# EAGLE design Overgang (EAGLE 6.4)
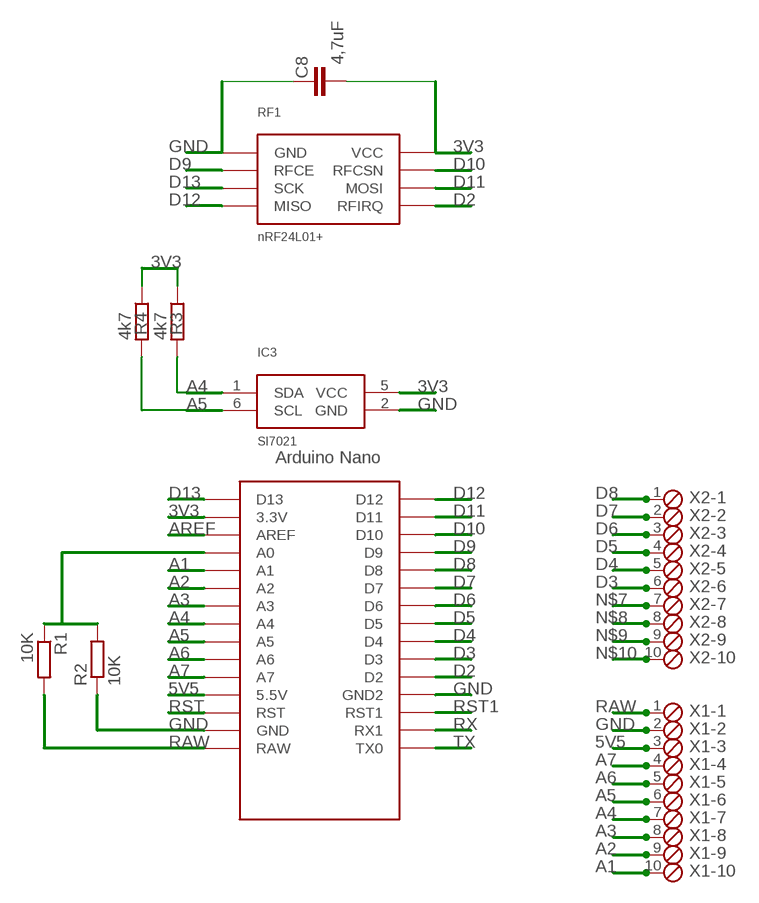
[diagram p0: schematic, sheet 1]

## Parts
C8  4,7uF  C-EUC1206K  [C1206K]
IC3  SI7021  [DFN6]
R1  10K  R-EU_R0805  [R0805]
R2  10K  R-EU_R0805  [R0805]
R3  4k7  R-EU_R0805  [R0805]
R4  4k7  R-EU_R0805  [R0805]
RF1  nRF24L01+  NRF24L01  [2X4-2.54MM]
U$1  NANO  [NANO]
X1  MPT10  [10POL254]
X2  MPT10  [10POL254]

## Nets
3V3: C8.1 IC3.5(VCC) R3.1 R4.1 RF1.P$2(VCC) U$1.3.3V
5V5: U$1.5V(5.5V) X1.3
A1: U$1.A1 X1.10
A2: U$1.A2 X1.9
A3: U$1.A3 X1.8
A4: IC3.1(SDA) R3.2 U$1.A4 X1.7
A5: IC3.6(SCL) R4.2 U$1.A5 X1.6
A6: U$1.A6 X1.5
A7: U$1.A7 X1.4
AREF: U$1.AREF
D2: RF1.P$8(RFIRQ) U$1.D2
D3: U$1.D3 X2.6
D4: U$1.D4 X2.5
D5: U$1.D5 X2.4
D6: U$1.D6 X2.3
D7: U$1.D7 X2.2
D8: U$1.D8 X2.1
D9: RF1.P$3(RFCE) U$1.D9
D10: RF1.P$4(RFCSN) U$1.D10
D11: RF1.P$6(MOSI) U$1.D11
D12: RF1.P$7(MISO) U$1.D12
D13: RF1.P$5(SCK) U$1.D13
GND: C8.2 IC3.2(GND) R2.1 RF1.P$1(GND) U$1.GND U$1.GND1(GND2) X1.2
N$2: R1.1 R2.2 U$1.A0
N$7: X2.7
N$8: X2.8
N$9: X2.9
N$10: X2.10
RAW: R1.2 U$1.RAW X1.1
RST: U$1.RST
RST1: U$1.RST1
RX: U$1.RX1
TX: U$1.TX0
Unconnected: U$1.ICSP1 U$1.ICSP2 U$1.ICSP3 U$1.ICSP4 U$1.ICSP5 U$1.ICSP6

## Library data of the parts
C8 = rcl:C-EU: CAPACITOR, European symbol
IC3 = Sensor:SI7021
R1-R4 = rcl:R-EU_: RESISTOR, European symbol
RF1 = matrix:NRF24L01
U$1 = AWP-Lib2:NANO: Arduino Nano
X1 X2 = con-phoenix-254:MPT10: PHOENIX CONNECTOR

## Net classes
0 default: width 0.203 mm

## Board
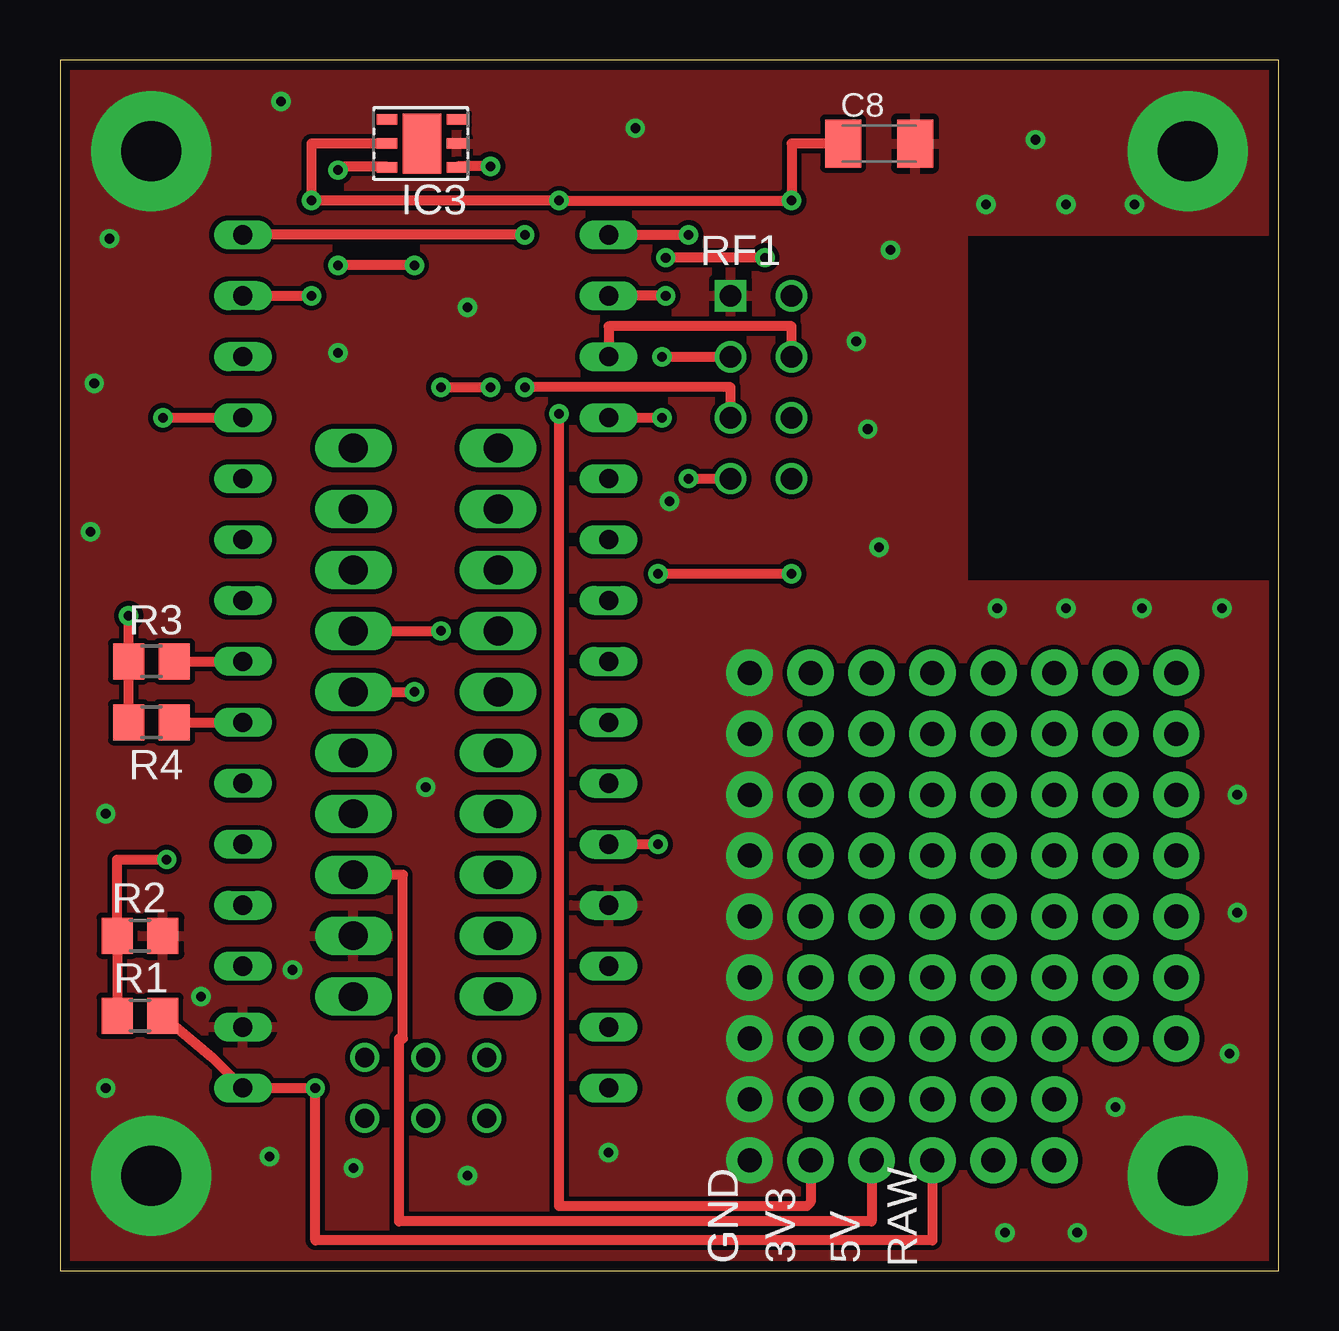
[diagram p1: board, top side]
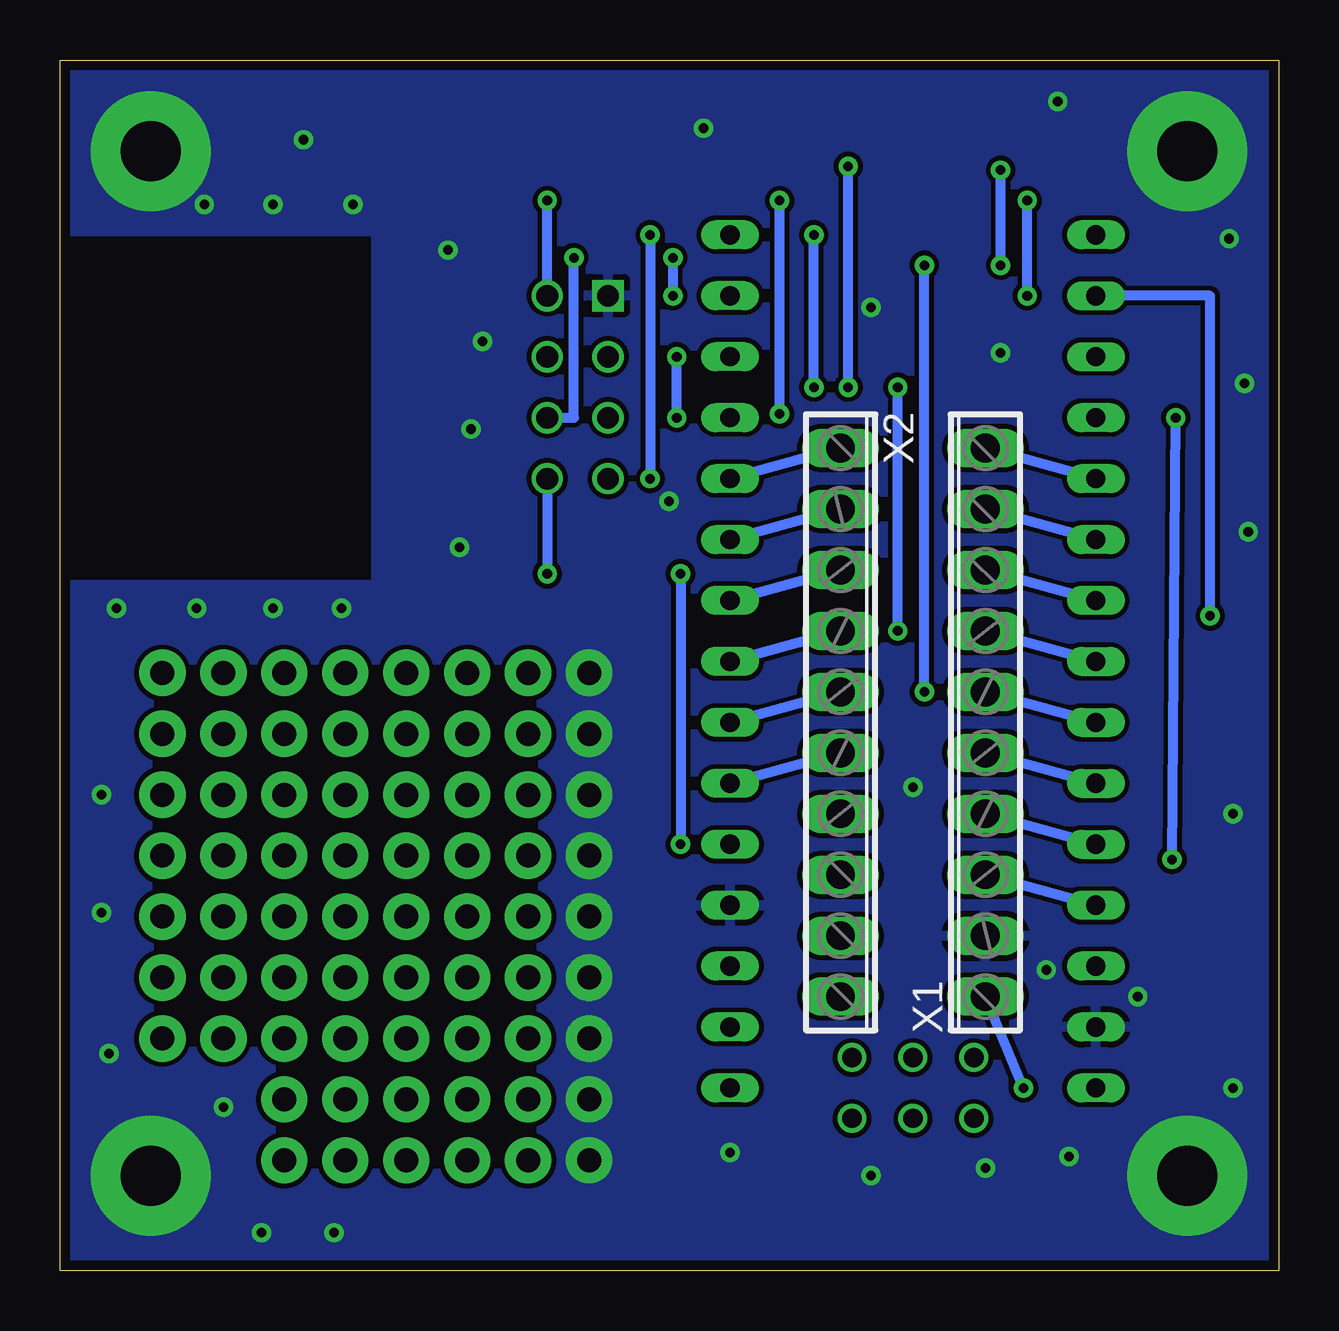
[diagram p2: board, bottom side, seen from below]

Size 50.78 x 50.47 mm. Coordinates in mm from the lower left corner, seen from the top.
Outline: 0,0 50.78,0 50.78,50.47 0,50.47 0,0
Copper layers (1*16): Top 0.035mm / dielectric 1.5mm / Bottom 0.035mm
Design rules "8mil_capinor": minimum track width 4mil, minimum drill 0.2997mm, track to track 8mil, track to pad 8mil, pad to pad 8mil, via to via 8mil, smd to smd 0mil, copper to edge 16mil, drill to drill 16mil, minimum pad ring 8mil, minimum via ring 8mil, stop-mask expansion 0mil, vias tented up to drill 16mil, thermal gap 10mil

### Footprints (pad centres in the part's own frame; a part is rotated, then mirrored left to right if it is on the bottom)
C1206K = smd 1.5 x 2: 1 -1.5,0; 2 1.5,0
DFN6 = smd 0.85 x 0.45: 1 -1.45,1; 2 -1.45,0; 3 -1.45,-1; 4 1.45,-1; 5 1.45,0; 6 1.45,1 | smd 1.6 x 2.5: P$1 0,0
R0805 = smd 1.3 x 1.5: 1 -0.95,0; 2 0.95,0
2X4-2.54MM = drill 0.9 square: P$1 0,0 | drill 0.9: P$2 2.54,0; P$3 0,-2.54; P$4 2.54,-2.54; P$5 0,-5.08; P$6 2.54,-5.08; P$7 0,-7.62; P$8 2.54,-7.62
NANO = drill 0.8 long: 3.3V -10.16,24.13; 5V -10.16,-1.27; A0 -10.16,19.05; A1 -10.16,16.51; A2 -10.16,13.97; A3 -10.16,11.43; A4 -10.16,8.89; A5 -10.16,6.35; A6 -10.16,3.81; A7 -10.16,1.27; AREF -10.16,21.59; D2 5.08,1.27; D3 5.08,3.81; D4 5.08,6.35; D5 5.08,8.89; D6 5.08,11.43; D7 5.08,13.97; D8 5.08,16.51; D9 5.08,19.05; D10 5.08,21.59; D11 5.08,24.13; D12 5.08,26.67; D13 -10.16,26.67; GND -10.16,-6.35; GND1 5.08,-1.27; RAW -10.16,-8.89; RST -10.16,-3.81; RST1 5.08,-3.81; RX1 5.08,-6.35; TX0 5.08,-8.89 | drill 0.8: ICSP1 -5.08,-10.16; ICSP2 -5.08,-7.62; ICSP3 -2.54,-10.16; ICSP4 -2.54,-7.62; ICSP5 0,-10.16; ICSP6 0,-7.62
10POL254 = drill 1.2 long: 1 -11.43,0; 2 -8.89,0; 3 -6.35,0; 4 -3.81,0; 5 -1.27,0; 6 1.27,0; 7 3.81,0; 8 6.35,0; 9 8.89,0; 10 11.43,0

### Placement (x,y rotation side)
C8  34.13,46.99 0 top
IC3  15.08,46.99 180 top
R1  3.33,10.64 0 top
R2  3.33,13.97 180 top
R3  3.81,25.4 0 top
R4  3.81,22.86 0 top
RF1  27.94,40.64 0 top
U$1  17.78,16.51 0 top
X1  12.22,22.86 90 bottom
X2  18.26,22.86 270 bottom

### Tracks (layer width: path | path; a pad name or v marks a point on that pad's centre or on a via)
3V3  (via drill 0.4, 1 pad 1.93)
  Top 0.406: U$1.3.3V v10.48,40.64 | R4.1 R3.1 v2.86,27.3 | IC3.5 10.48,46.99 v10.48,44.61 v20.8,44.61 v30.48,44.61 30.48,46.99 C8.1 | v31.27,4.6 31.27,2.86 31.11,2.7 20.8,2.7 v20.8,35.72
  Bottom 0.406: RF1.P$2 v30.48,44.61 | v10.48,40.64 v10.48,44.61 | v2.86,27.3 2.86,40.64 U$1.3.3V | v20.8,35.72 v20.8,44.61
5V5  (via drill 1 pad 1.93)
  Top 0.406: v33.81,4.6 33.81,2.06 14.13,2.06 14.13,9.68 14.29,9.68 14.29,16.51 X1.3
  Bottom 0.406: U$1.5V X1.3
A1
  Bottom 0.406: U$1.A1 X1.10
A2
  Bottom 0.406: U$1.A2 X1.9
A3
  Bottom 0.406: U$1.A3 X1.8
A4  (via drill 0.4)
  Top 0.406: R3.2 U$1.A4 | X1.7 v15.88,26.67 | v15.88,36.83 v17.94,36.83 | v17.94,46.04 16.58,46.04 IC3.1
  Bottom 0.406: U$1.A4 X1.7 | v15.88,26.67 v15.88,36.83 | v17.94,36.83 v17.94,46.04
A5  (via drill 0.4)
  Top 0.406: R4.2 U$1.A5 | X1.6 v14.76,24.13 | v14.76,41.91 v11.59,41.91 | v11.59,45.88 11.75,46.04 13.58,46.04 IC3.6
  Bottom 0.406: U$1.A5 X1.6 | v14.76,24.13 v14.76,41.91 | v11.59,41.91 v11.59,45.88
A6
  Bottom 0.406: U$1.A6 X1.5
A7
  Bottom 0.406: U$1.A7 X1.4
D2  (via drill 0.4)
  Top 0.406: v30.48,29.05 v24.92,29.05 | v24.92,17.78 U$1.D2
  Bottom 0.406: RF1.P$8 v30.48,29.05 | v24.92,29.05 v24.92,17.78
D3
  Bottom 0.406: X2.6 U$1.D3
D4
  Bottom 0.406: X2.5 U$1.D4
D5
  Bottom 0.406: X2.4 U$1.D5
D6
  Bottom 0.406: X2.3 U$1.D6
D7
  Bottom 0.406: X2.2 U$1.D7
D8
  Bottom 0.406: X2.1 U$1.D8
D9  (via drill 0.4)
  Top 0.406: U$1.D9 v25.08,35.56 | v25.08,38.1 RF1.P$3
  Bottom 0.406: v25.08,35.56 v25.08,38.1
D10
  Top 0.406: RF1.P$4 30.48,39.37 22.86,39.37 U$1.D10
D11  (via drill 0.4)
  Top 0.406: v29.37,42.23 v25.24,42.23 | v25.24,40.64 U$1.D11
  Bottom 0.406: RF1.P$6 29.37,35.56 v29.37,42.23 | v25.24,42.23 v25.24,40.64
D12  (via drill 0.4)
  Top 0.406: U$1.D12 v26.19,43.18 | v26.19,33.02 RF1.P$7 28.1,33.02
  Bottom 0.406: v26.19,43.18 v26.19,33.02
D13  (via drill 0.4)
  Top 0.406: RF1.P$5 27.94,36.83 v19.37,36.83 | v19.37,43.18 U$1.D13
  Bottom 0.406: v19.37,36.83 v19.37,43.18
GND  (via drill 0.4, 1 pad 1.93, 2.5 pad 5)
  other vias: 3.81,3.97 46.99,3.97 46.99,46.67 3.81,46.67 33.18,38.73 28.73,4.6 28.73,7.14 28.73,9.68 28.73,12.22 28.73,14.76 28.73,17.3 28.73,19.84 28.73,22.38 28.73,24.92 33.66,35.08 34.13,30.16 34.61,42.55 40.64,47.15 38.58,44.45 41.91,44.45 44.77,44.45 23.97,47.62 9.21,48.74 2.06,43.02 1.43,36.99 1.27,30.8 1.91,19.05 11.59,38.26 16.99,40.16 25.4,32.07 1.91,7.62 8.73,4.76 22.86,4.92 39.05,27.62 41.91,27.62 45.09,27.62 48.42,27.62 16.99,3.97 15.24,20.16 12.22,4.29 39.37,1.59 42.39,1.59 43.97,6.83 48.74,9.05 49.05,14.92 49.05,19.84 5.87,11.43 9.68,12.54
  pour Bottom: 0,50.48 50.8,50.48 50.8,43.34 37.62,43.34 37.62,28.58 50.8,28.58 50.8,0 0,0
  pour Top: 0,50.48 50.8,50.48 50.8,43.34 37.62,43.34 37.62,28.58 50.8,28.58 50.8,0 0,0
N$1  (via drill 1 pad 1.93)
  other vias: 33.81,24.92
N$2  (via drill 0.4)
  Top 0.406: v4.45,17.14 2.38,17.14 R2.2 R1.1 | v4.29,35.56 U$1.A0
  Bottom 0.406: v4.45,17.14 v4.29,35.56
N$3  (via drill 1 pad 1.93)
  other vias: 36.35,22.38
N$4  (via drill 1 pad 1.93)
  other vias: 36.35,24.92
N$5  (via drill 1 pad 1.93)
  other vias: 38.89,22.38
N$6  (via drill 1 pad 1.93)
  other vias: 38.89,24.92
N$11  (via drill 1 pad 1.93)
  other vias: 43.97,22.38
N$12  (via drill 1 pad 1.93)
  other vias: 46.51,22.38
N$13  (via drill 1 pad 1.93)
  other vias: 46.51,24.92
N$17  (via drill 1 pad 1.93)
  other vias: 36.35,17.3
N$18  (via drill 1 pad 1.93)
  other vias: 31.27,17.3
N$19  (via drill 1 pad 1.93)
  other vias: 38.89,17.3
N$20  (via drill 1 pad 1.93)
  other vias: 38.89,19.84
N$21  (via drill 1 pad 1.93)
  other vias: 43.97,17.3
N$22  (via drill 1 pad 1.93)
  other vias: 46.51,17.3
N$23  (via drill 1 pad 1.93)
  other vias: 46.51,19.84
N$27  (via drill 1 pad 1.93)
  other vias: 36.35,12.22
N$28  (via drill 1 pad 1.93)
  other vias: 36.35,14.76
N$29  (via drill 1 pad 1.93)
  other vias: 38.89,12.22
N$30  (via drill 1 pad 1.93)
  other vias: 38.89,14.76
N$31  (via drill 1 pad 1.93)
  other vias: 43.97,12.22
N$32  (via drill 1 pad 1.93)
  other vias: 46.51,12.22
N$33  (via drill 1 pad 1.93)
  other vias: 46.51,14.76
N$37  (via drill 1 pad 1.93)
  other vias: 36.35,7.14
N$38  (via drill 1 pad 1.93)
  other vias: 31.27,7.14
N$39  (via drill 1 pad 1.93)
  other vias: 38.89,7.14
N$40  (via drill 1 pad 1.93)
  other vias: 38.89,9.68
N$43  (via drill 1 pad 1.93)
  other vias: 46.51,9.68
N$46  (via drill 1 pad 1.93)
  other vias: 38.89,4.6
N$47  (via drill 1 pad 1.93)
  other vias: 41.43,4.6
N$49  (via drill 1 pad 1.93)
  other vias: 33.81,22.38
N$50  (via drill 1 pad 1.93)
  other vias: 31.27,24.92
N$51  (via drill 1 pad 1.93)
  other vias: 41.43,24.92
N$52  (via drill 1 pad 1.93)
  other vias: 43.97,24.92
N$53  (via drill 1 pad 1.93)
  other vias: 41.43,22.38
N$54  (via drill 1 pad 1.93)
  other vias: 41.43,19.84
N$55  (via drill 1 pad 1.93)
  other vias: 43.97,19.84
N$56  (via drill 1 pad 1.93)
  other vias: 41.43,17.3
N$57  (via drill 1 pad 1.93)
  other vias: 36.35,19.84
N$58  (via drill 1 pad 1.93)
  other vias: 33.81,19.84
N$59  (via drill 1 pad 1.93)
  other vias: 33.81,17.3
N$60  (via drill 1 pad 1.93)
  other vias: 31.27,19.84
N$62  (via drill 1 pad 1.93)
  other vias: 31.27,12.22
N$63  (via drill 1 pad 1.93)
  other vias: 31.27,14.76
N$65  (via drill 1 pad 1.93)
  other vias: 33.81,12.22
N$66  (via drill 1 pad 1.93)
  other vias: 33.81,14.76
N$67  (via drill 1 pad 1.93)
  other vias: 41.43,14.76
N$68  (via drill 1 pad 1.93)
  other vias: 43.97,14.76
N$69  (via drill 1 pad 1.93)
  other vias: 41.43,12.22
N$70  (via drill 1 pad 1.93)
  other vias: 41.43,9.68
N$71  (via drill 1 pad 1.93)
  other vias: 43.97,9.68
N$72  (via drill 1 pad 1.93)
  other vias: 41.43,7.14
N$73  (via drill 1 pad 1.93)
  other vias: 36.35,9.68
N$74  (via drill 1 pad 1.93)
  other vias: 33.81,9.68
N$75  (via drill 1 pad 1.93)
  other vias: 31.27,9.68
N$76  (via drill 1 pad 1.93)
  other vias: 33.81,7.14
N$81  (via drill 1 pad 1.93)
  other vias: 31.27,22.38
RAW  (via drill 0.4, 1 pad 1.93)
  Top 0.406: R1.2 6.35,8.89 U$1.RAW v10.64,7.62 10.64,1.27 36.35,1.27 v36.35,4.6
  Bottom 0.406: v10.64,7.62 X1.1

### Text on the board
_tsilk: GND | GND | 3V3 | 5V | RAW